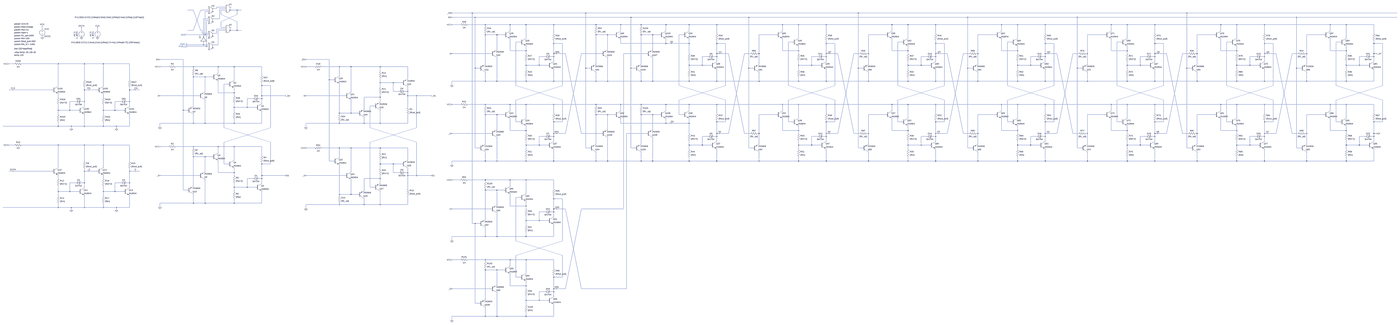
[diagram p0: schematic register.asc, whole sheet]
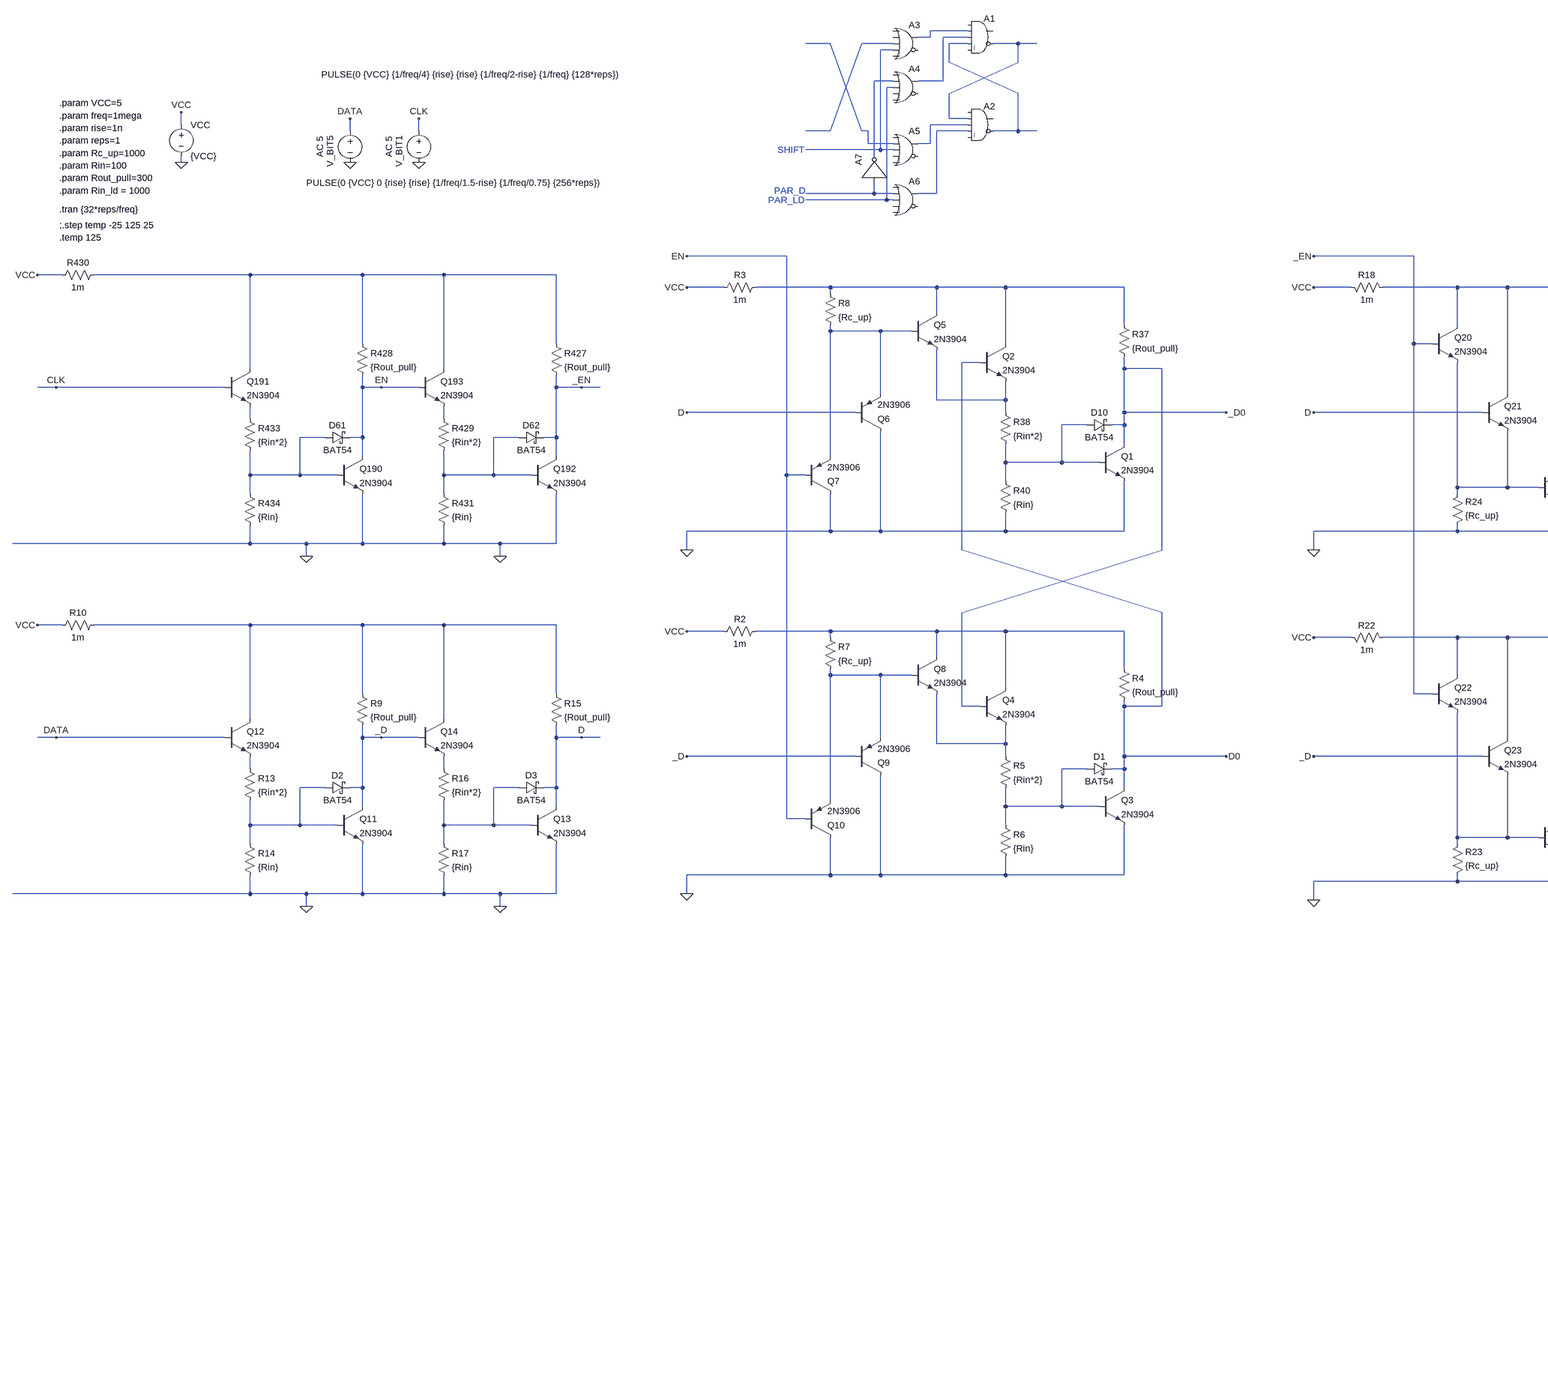
[diagram p1: schematic register.asc, part, row 1 of 1, column 1 of 4]
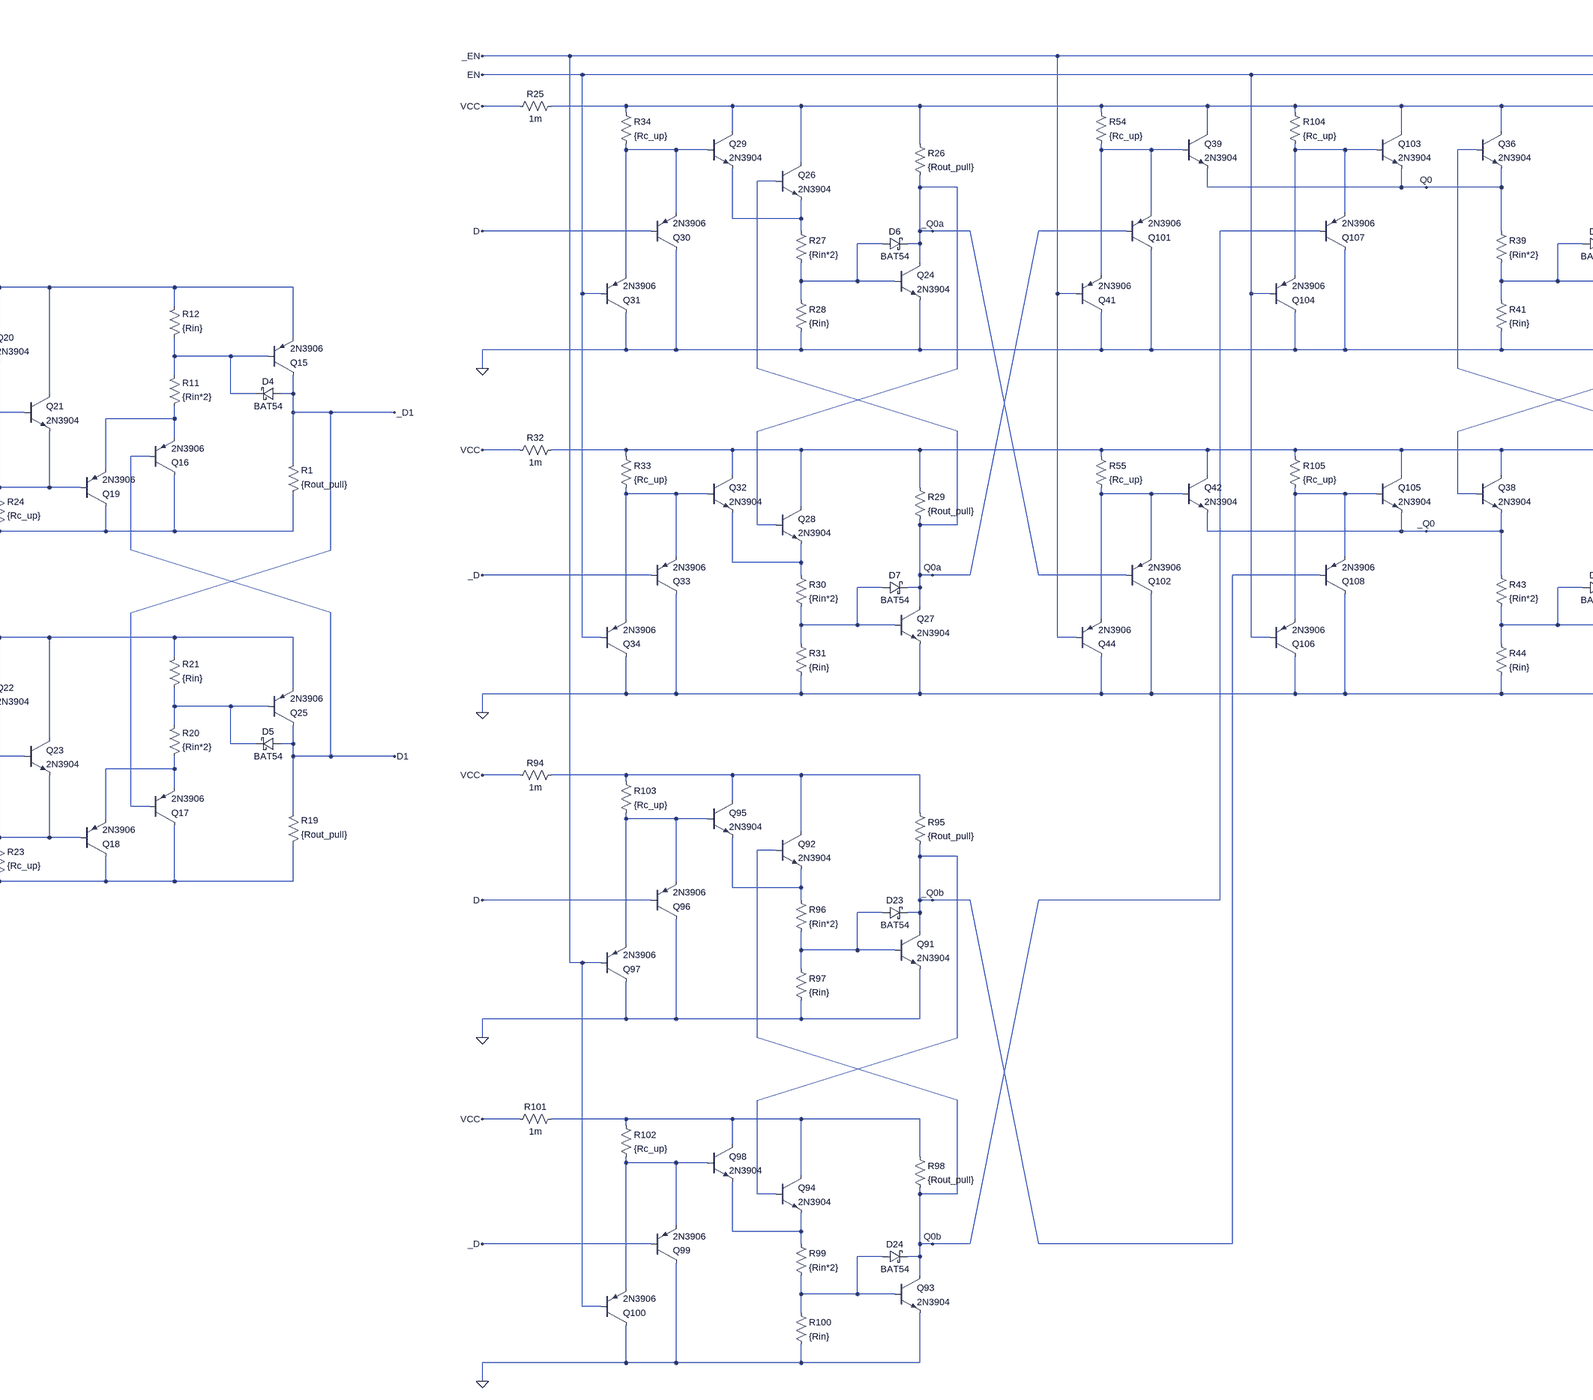
[diagram p2: schematic register.asc, part, row 1 of 1, column 2 of 4]
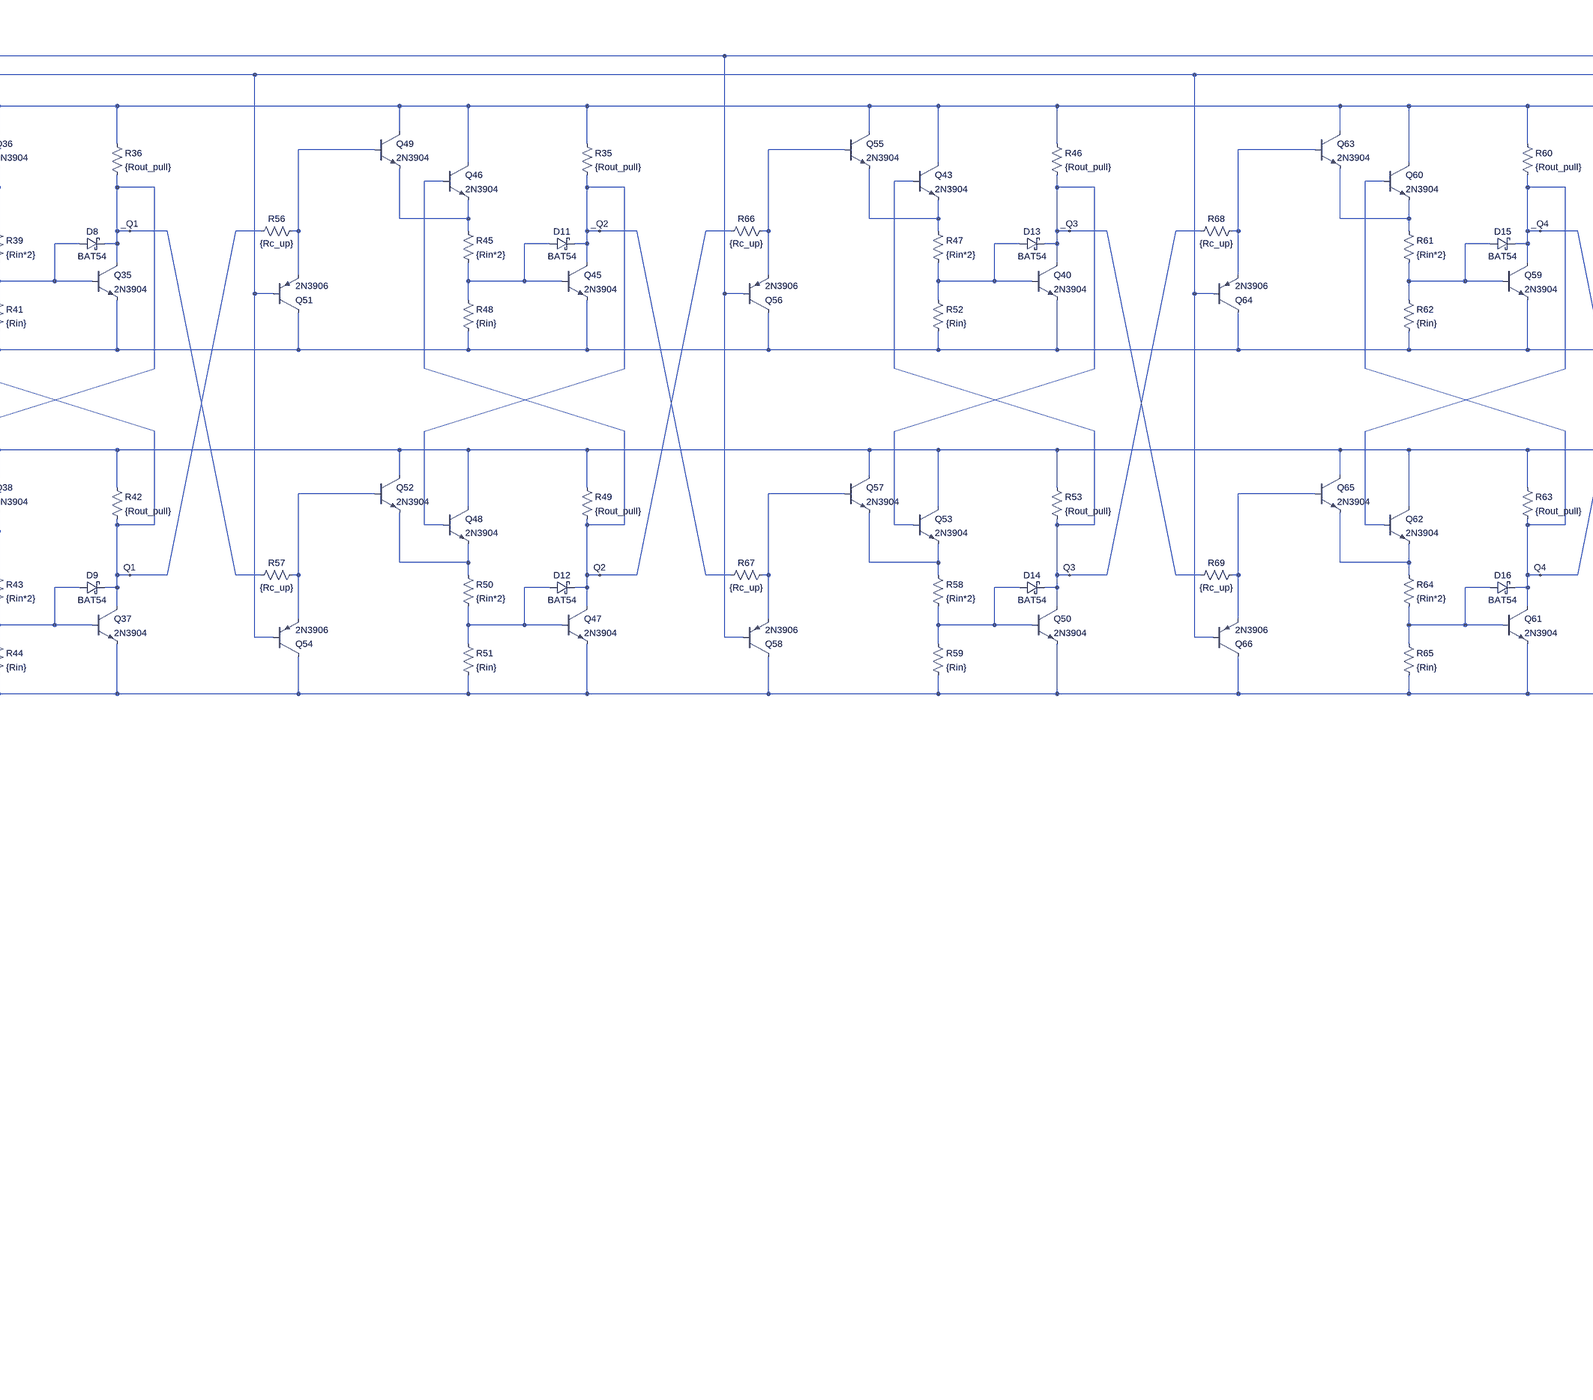
[diagram p3: schematic register.asc, part, row 1 of 1, column 3 of 4]
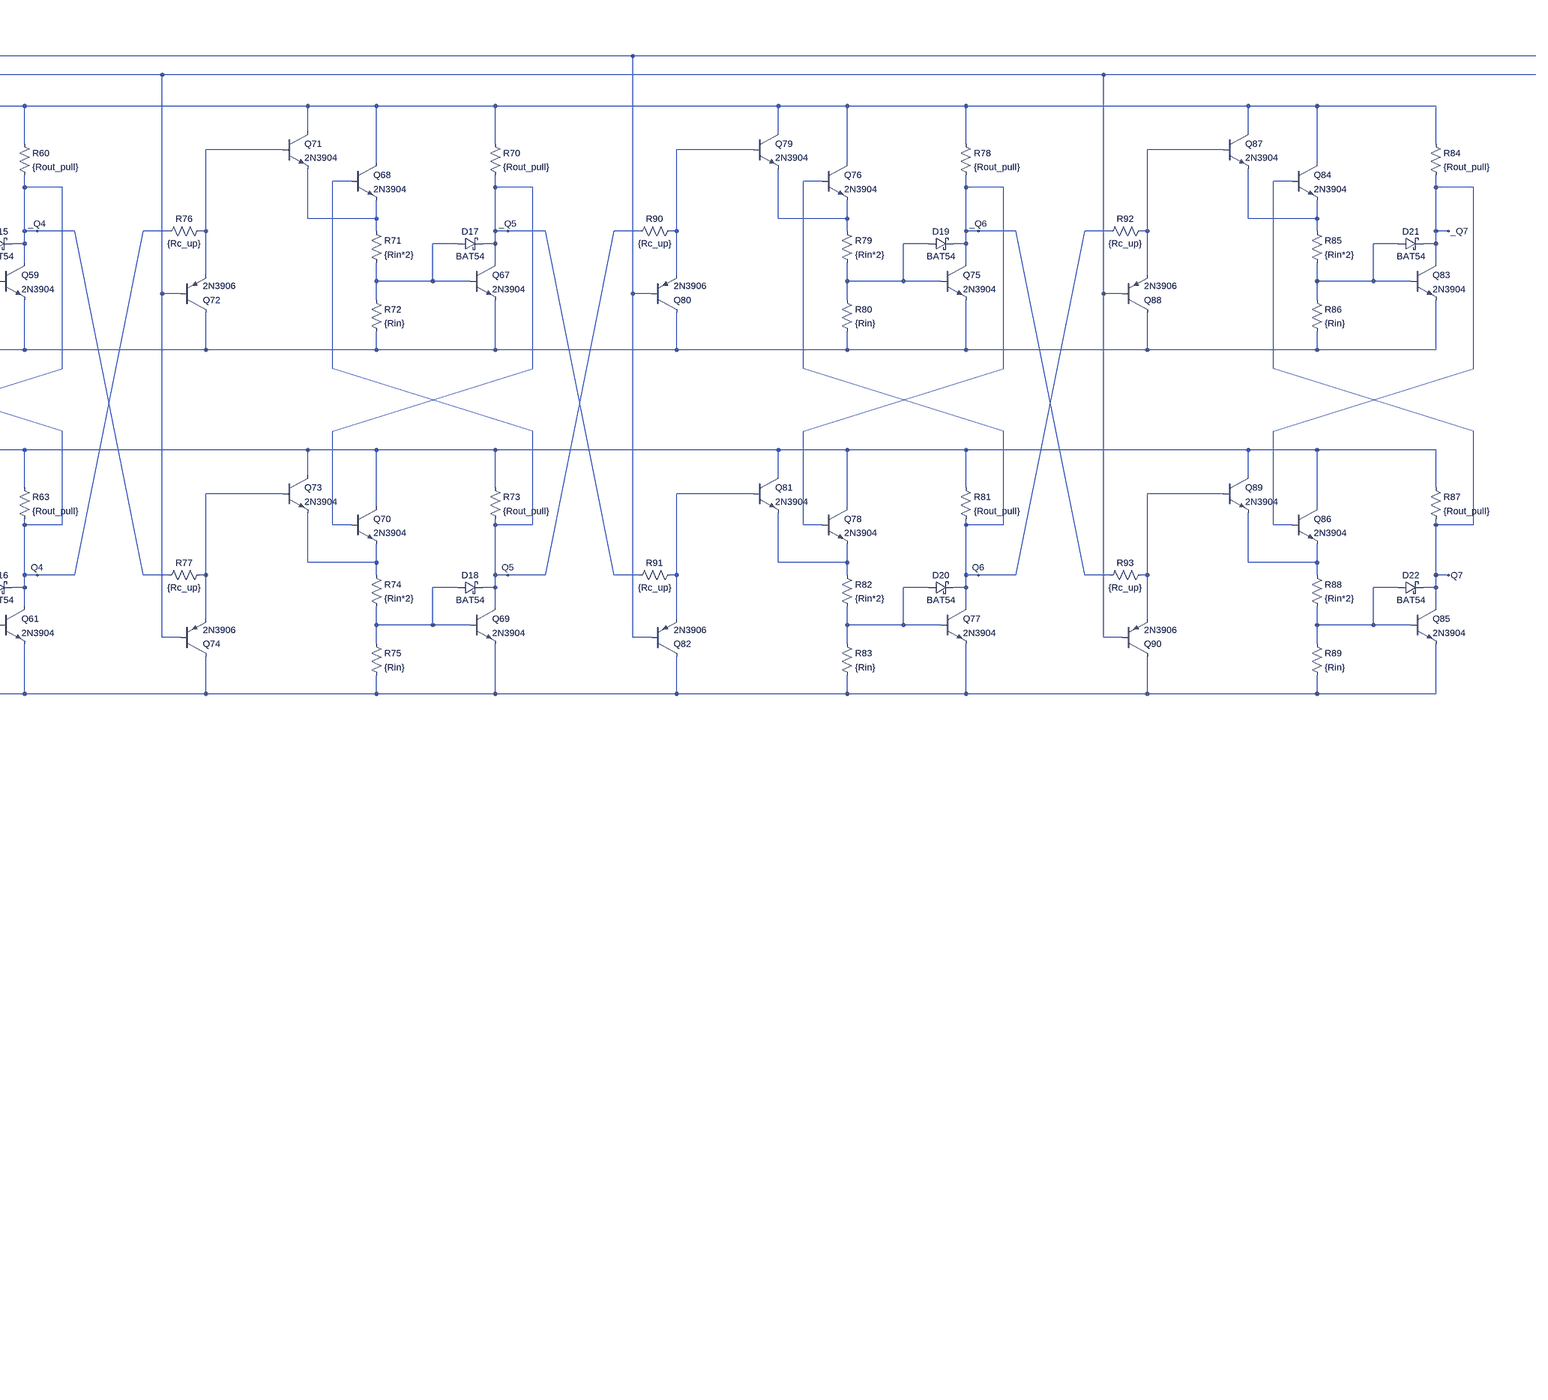
[diagram p4: schematic register.asc, part, row 1 of 1, column 4 of 4]
* register.asc
VCC VCC 0 {VCC}
V_BIT5 DATA 0 PULSE(0 {VCC} 0 {rise} {rise} {1/freq/1.5-rise} {1/freq/0.75} {256*reps}) AC 5
A1 0 N001 N002 N005 0 N006 0 0 AND
A2 0 N006 N011 N012 0 N005 0 0 AND
A3 0 0 N004 N007 0 0 N001 0 OR
A4 0 N008 N009 0 0 0 N002 0 OR
A5 0 N003 N007 0 0 0 N011 0 OR
A6 0 N022 N009 0 0 0 N012 0 OR
A7 N022 0 0 0 0 N008 0 0 BUF
Q190 EN N048 0 0 2N3904
D61 N048 EN BAT54
R428 N038 EN {Rout_pull}
R430 VCC N038 1m
Q191 N038 CLK N044 0 2N3904
R433 N044 N048 {Rin*2}
R434 N048 0 {Rin}
Q192 _EN N049 0 0 2N3904
D62 N049 _EN BAT54
R427 N038 _EN {Rout_pull}
Q193 N038 EN N045 0 2N3904
R429 N045 N049 {Rin*2}
R431 N049 0 {Rin}
Q1 _D0 N047 0 0 2N3904
D10 N047 _D0 BAT54
R3 VCC N039 1m
Q2 N039 D0 N043 0 2N3904
R37 N039 _D0 {Rout_pull}
R38 N043 N047 {Rin*2}
R40 N047 0 {Rin}
Q3 D0 N084 0 0 2N3904
D1 N084 D0 BAT54
Q4 N077 _D0 N081 0 2N3904
R4 N077 D0 {Rout_pull}
R5 N081 N084 {Rin*2}
R6 N084 0 {Rin}
Q5 N039 N041 N043 0 2N3904
Q6 0 D N041 0 2N3906
Q7 0 EN N041 0 2N3906
R2 VCC N077 1m
Q8 N077 N079 N081 0 2N3904
Q9 0 _D N079 0 2N3906
Q10 0 EN N079 0 2N3906
R7 N077 N079 {Rc_up}
R8 N039 N041 {Rc_up}
Q11 _D N087 0 0 2N3904
D2 N087 _D BAT54
R9 N076 _D {Rout_pull}
R10 VCC N076 1m
Q12 N076 DATA N082 0 2N3904
R13 N082 N087 {Rin*2}
R14 N087 0 {Rin}
Q13 D N088 0 0 2N3904
D3 N088 D BAT54
R15 N076 D {Rout_pull}
Q14 N076 _D N083 0 2N3904
R16 N083 N088 {Rin*2}
R17 N088 0 {Rin}
V_BIT1 CLK 0 PULSE(0 {VCC} {1/freq/4} {rise} {rise} {1/freq/2-rise} {1/freq} {128*reps}) AC 5
D5 D1 N080 BAT54
R19 0 D1 {Rout_pull}
R20 N085 N080 {Rin*2}
R21 N080 N078 {Rin}
R22 VCC N078 1m
R23 0 N090 {Rc_up}
Q25 D1 N080 N078 0 2N3906
Q17 0 _D1 N085 0 2N3906
Q18 0 N090 N085 0 2N3906
Q22 N078 _EN N090 0 2N3904
Q23 N078 _D N090 0 2N3904
D4 _D1 N042 BAT54
R1 0 _D1 {Rout_pull}
R11 N046 N042 {Rin*2}
R12 N042 N040 {Rin}
R18 VCC N040 1m
R24 0 N051 {Rc_up}
Q15 _D1 N042 N040 0 2N3906
Q16 0 D1 N046 0 2N3906
Q19 0 N051 N046 0 2N3906
Q20 N040 _EN N051 0 2N3904
Q21 N040 D N051 0 2N3904
Q24 _Q0a N030 0 0 2N3904
D6 N030 _Q0a BAT54
R25 VCC N010 1m
Q26 N010 Q0a N023 0 2N3904
R26 N010 _Q0a {Rout_pull}
R27 N023 N030 {Rin*2}
R28 N030 0 {Rin}
Q27 Q0a N068 0 0 2N3904
D7 N068 Q0a BAT54
Q28 N050 _Q0a N061 0 2N3904
R29 N050 Q0a {Rout_pull}
R30 N061 N068 {Rin*2}
R31 N068 0 {Rin}
Q29 N010 N013 N023 0 2N3904
Q30 0 D N013 0 2N3906
Q31 0 EN N013 0 2N3906
R32 VCC N050 1m
Q32 N050 N052 N061 0 2N3904
Q33 0 _D N052 0 2N3906
Q34 0 EN N052 0 2N3906
R33 N050 N052 {Rc_up}
R34 N010 N013 {Rc_up}
Q35 _Q1 N031 0 0 2N3904
D8 N031 _Q1 BAT54
Q36 N010 Q1 Q0 0 2N3904
R36 N010 _Q1 {Rout_pull}
R39 Q0 N031 {Rin*2}
R41 N031 0 {Rin}
Q37 Q1 N069 0 0 2N3904
D9 N069 Q1 BAT54
Q38 N050 _Q1 _Q0 0 2N3904
R42 N050 Q1 {Rout_pull}
R43 _Q0 N069 {Rin*2}
R44 N069 0 {Rin}
Q39 N010 N014 Q0 0 2N3904
Q41 0 _EN N014 0 2N3906
Q42 N050 N053 _Q0 0 2N3904
Q44 0 _EN N053 0 2N3906
Q45 _Q2 N032 0 0 2N3904
D11 N032 _Q2 BAT54
Q46 N010 Q2 N024 0 2N3904
R35 N010 _Q2 {Rout_pull}
R45 N024 N032 {Rin*2}
R48 N032 0 {Rin}
Q47 Q2 N070 0 0 2N3904
D12 N070 Q2 BAT54
Q48 N050 _Q2 N062 0 2N3904
R49 N050 Q2 {Rout_pull}
R50 N062 N070 {Rin*2}
R51 N070 0 {Rin}
Q49 N010 N016 N024 0 2N3904
Q51 0 EN N016 0 2N3906
Q52 N050 N055 N062 0 2N3904
Q54 0 EN N055 0 2N3906
R54 N010 N014 {Rc_up}
R55 N050 N053 {Rc_up}
R56 N016 Q1 {Rc_up}
R57 N055 _Q1 {Rc_up}
Q40 _Q3 N033 0 0 2N3904
D13 N033 _Q3 BAT54
Q43 N010 Q3 N025 0 2N3904
R46 N010 _Q3 {Rout_pull}
R47 N025 N033 {Rin*2}
R52 N033 0 {Rin}
Q50 Q3 N071 0 0 2N3904
D14 N071 Q3 BAT54
Q53 N050 _Q3 N063 0 2N3904
R53 N050 Q3 {Rout_pull}
R58 N063 N071 {Rin*2}
R59 N071 0 {Rin}
Q55 N010 N017 N025 0 2N3904
Q56 0 _EN N017 0 2N3906
Q57 N050 N056 N063 0 2N3904
Q58 0 _EN N056 0 2N3906
Q59 _Q4 N034 0 0 2N3904
D15 N034 _Q4 BAT54
Q60 N010 Q4 N026 0 2N3904
R60 N010 _Q4 {Rout_pull}
R61 N026 N034 {Rin*2}
R62 N034 0 {Rin}
Q61 Q4 N072 0 0 2N3904
D16 N072 Q4 BAT54
Q62 N050 _Q4 N064 0 2N3904
R63 N050 Q4 {Rout_pull}
R64 N064 N072 {Rin*2}
R65 N072 0 {Rin}
Q63 N010 N018 N026 0 2N3904
Q64 0 EN N018 0 2N3906
Q65 N050 N057 N064 0 2N3904
Q66 0 EN N057 0 2N3906
R66 N017 Q2 {Rc_up}
R67 N056 _Q2 {Rc_up}
R68 N018 Q3 {Rc_up}
R69 N057 _Q3 {Rc_up}
Q67 _Q5 N035 0 0 2N3904
D17 N035 _Q5 BAT54
Q68 N010 Q5 N027 0 2N3904
R70 N010 _Q5 {Rout_pull}
R71 N027 N035 {Rin*2}
R72 N035 0 {Rin}
Q69 Q5 N073 0 0 2N3904
D18 N073 Q5 BAT54
Q70 N050 _Q5 N065 0 2N3904
R73 N050 Q5 {Rout_pull}
R74 N065 N073 {Rin*2}
R75 N073 0 {Rin}
Q71 N010 N019 N027 0 2N3904
Q72 0 EN N019 0 2N3906
Q73 N050 N058 N065 0 2N3904
Q74 0 EN N058 0 2N3906
R76 N019 Q4 {Rc_up}
R77 N058 _Q4 {Rc_up}
Q75 _Q6 N036 0 0 2N3904
D19 N036 _Q6 BAT54
Q76 N010 Q6 N028 0 2N3904
R78 N010 _Q6 {Rout_pull}
R79 N028 N036 {Rin*2}
R80 N036 0 {Rin}
Q77 Q6 N074 0 0 2N3904
D20 N074 Q6 BAT54
Q78 N050 _Q6 N066 0 2N3904
R81 N050 Q6 {Rout_pull}
R82 N066 N074 {Rin*2}
R83 N074 0 {Rin}
Q79 N010 N020 N028 0 2N3904
Q80 0 _EN N020 0 2N3906
Q81 N050 N059 N066 0 2N3904
Q82 0 _EN N059 0 2N3906
Q83 _Q7 N037 0 0 2N3904
D21 N037 _Q7 BAT54
Q84 N010 Q7 N029 0 2N3904
R84 N010 _Q7 {Rout_pull}
R85 N029 N037 {Rin*2}
R86 N037 0 {Rin}
Q85 Q7 N075 0 0 2N3904
D22 N075 Q7 BAT54
Q86 N050 _Q7 N067 0 2N3904
R87 N050 Q7 {Rout_pull}
R88 N067 N075 {Rin*2}
R89 N075 0 {Rin}
Q87 N010 N021 N029 0 2N3904
Q88 0 EN N021 0 2N3906
Q89 N050 N060 N067 0 2N3904
Q90 0 EN N060 0 2N3906
R90 N020 Q5 {Rc_up}
R91 N059 _Q5 {Rc_up}
R92 N021 Q6 {Rc_up}
R93 N060 _Q6 {Rc_up}
Q91 _Q0b N092 0 0 2N3904
D23 N092 _Q0b BAT54
R94 VCC N086 1m
Q92 N086 Q0b N091 0 2N3904
R95 N086 _Q0b {Rout_pull}
R96 N091 N092 {Rin*2}
R97 N092 0 {Rin}
Q93 Q0b N096 0 0 2N3904
D24 N096 Q0b BAT54
Q94 N093 _Q0b N095 0 2N3904
R98 N093 Q0b {Rout_pull}
R99 N095 N096 {Rin*2}
R100 N096 0 {Rin}
Q95 N086 N089 N091 0 2N3904
Q96 0 D N089 0 2N3906
Q97 0 _EN N089 0 2N3906
R101 VCC N093 1m
Q98 N093 N094 N095 0 2N3904
Q99 0 _D N094 0 2N3906
Q100 0 _EN N094 0 2N3906
R102 N093 N094 {Rc_up}
R103 N086 N089 {Rc_up}
Q101 0 Q0a N014 0 2N3906
Q102 0 _Q0a N053 0 2N3906
Q103 N010 N015 Q0 0 2N3904
Q104 0 EN N015 0 2N3906
Q105 N050 N054 _Q0 0 2N3904
Q106 0 EN N054 0 2N3906
R104 N010 N015 {Rc_up}
R105 N050 N054 {Rc_up}
Q107 0 Q0b N015 0 2N3906
Q108 0 _Q0b N054 0 2N3906
.model D D
.lib standard.dio
.model NPN NPN
.model PNP PNP
.lib standard.bjt
.tran {32*reps/freq}
.param VCC=5
.param freq=1mega
.param rise=1n
.param reps=1
* PAR_LD
* PAR_D
* SHIFT
.param Rin=100
.param Rout_pull=300
.param Rin_ld = 1000
.param Rc_up=1000
;.step temp -25 125 25
.temp 125
.backanno
.end